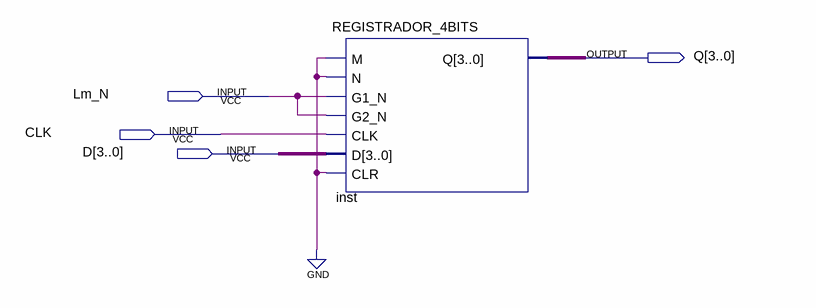
[diagram p0: schematic sheet]
// Quartus schematic REM.bdf as structural Verilog: 1 symbols, 4 pins
module REM (
  input  Lm_N,
  input  CLK,
  input  [3:0] D,
  output [3:0] Q
);

  REGISTRADOR_4BITS inst (.M(1'b0), .N(1'b0), .G1_N(Lm_N), .G2_N(Lm_N), .CLK(CLK), .D(D), .CLR(1'b0), .Q(Q));
endmodule
